# Altium schematic sheet SCH11_Digital_IO.SchDoc: Beaglebone Black - Digital IO
size B; Organization: CWRUbotix; Address1: 10900 Euclid Avenue; Address2: Cleveland, OH 44106; Address3: USA; Revision: 1.0; SheetNumber: 11; SheetTotal: 13
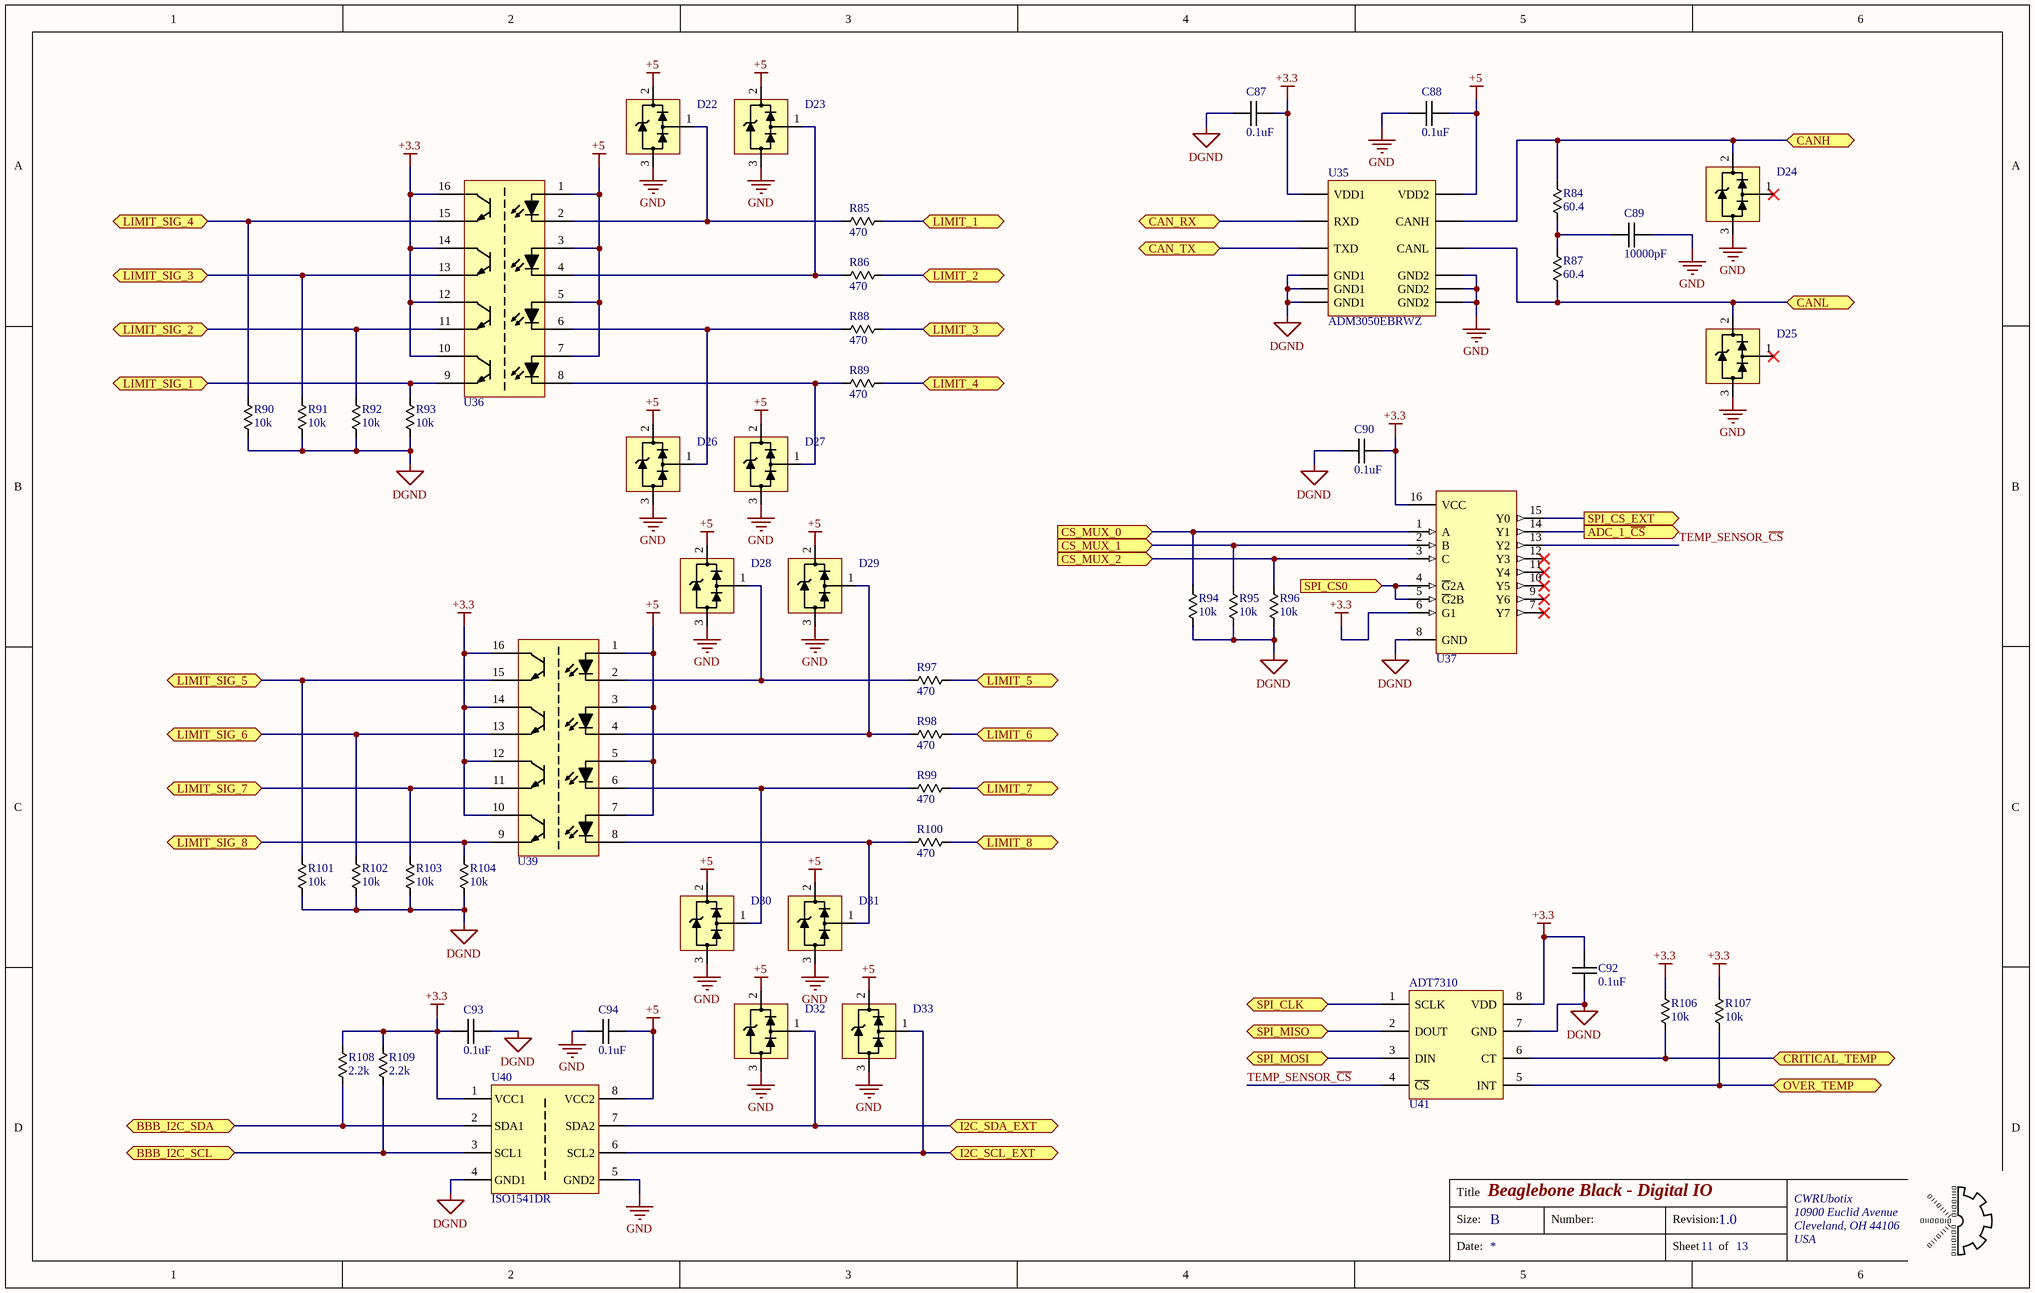
[diagram p0: SCH11_Digital_IO.SchDoc]

## Parts
C87  0.1uF  [chip_0603]
C88  0.1uF  [chip_0603]
C89  10000pF  [chip_0603]
C90  0.1uF  [chip_0603]
C92  0.1uF  [chip_0603]
C93  0.1uF  [chip_0603]
C94  0.1uF  [chip_0603]
D22  DLPT05  [sot-23-3]  (value not drawn)
D23  DLPT05  [sot-23-3]  (value not drawn)
D24  DLPT05  [sot-23-3]  (value not drawn)
D25  DLPT05  [sot-23-3]  (value not drawn)
D26  DLPT05  [sot-23-3]  (value not drawn)
D27  DLPT05  [sot-23-3]  (value not drawn)
D28  DLPT05  [sot-23-3]  (value not drawn)
D29  DLPT05  [sot-23-3]  (value not drawn)
D30  DLPT05  [sot-23-3]  (value not drawn)
D31  DLPT05  [sot-23-3]  (value not drawn)
D32  DLPT05  [sot-23-3]  (value not drawn)
D33  DLPT05  [sot-23-3]  (value not drawn)
R84  60.4  [chip_0805]
R85  470  [chip_0805]
R86  470  [chip_0805]
R87  60.4  [chip_0805]
R88  470  [chip_0805]
R89  470  [chip_0805]
R90  10k  [chip_0603]
R91  10k  [chip_0603]
R92  10k  [chip_0603]
R93  10k  [chip_0603]
R94  10k  [chip_0603]
R95  10k  [chip_0603]
R96  10k  [chip_0603]
R97  470  [chip_0805]
R98  470  [chip_0805]
R99  470  [chip_0805]
R100  470  [chip_0805]
R101  10k  [chip_0603]
R102  10k  [chip_0603]
R103  10k  [chip_0603]
R104  10k  [chip_0603]
R106  10k  [chip_0603]
R107  10k  [chip_0603]
R108  2.2k  [chip_0603]
R109  2.2k  [chip_0603]
U35  ADM3050EBRWZ  [SOW-16]
U36  TLP291-4  [SO-16-6.3mm]  (value not drawn)
U37  74HC138  [SO-16]  (value not drawn)
U39  TLP291-4  [SO-16-6.3mm]  (value not drawn)
U40  ISO1541DR  [SO-8]
U41  ADT7310  [SO-8_1]

## Ports
ADC_1_~{CS} (out), BBB_I2C_SCL (bidir), BBB_I2C_SDA (bidir), CAN_RX (bidir), CAN_TX (bidir), CANH (bidir), CANL (bidir), CRITICAL_TEMP (bidir), CS_MUX_0 (in), CS_MUX_1 (in), CS_MUX_2 (in), I2C_SCL_EXT (bidir), I2C_SDA_EXT (bidir), LIMIT_1 (bidir), LIMIT_2 (bidir), LIMIT_3 (bidir), LIMIT_4 (bidir), LIMIT_5 (bidir), LIMIT_6 (bidir), LIMIT_7 (bidir), LIMIT_8 (bidir), LIMIT_SIG_1 (bidir), LIMIT_SIG_2 (bidir), LIMIT_SIG_3 (bidir), LIMIT_SIG_4 (bidir), LIMIT_SIG_5 (bidir), LIMIT_SIG_6 (bidir), LIMIT_SIG_7 (bidir), LIMIT_SIG_8 (bidir), OVER_TEMP (bidir), SPI_CLK (bidir), SPI_CS0 (in), SPI_CS_EXT (out), SPI_MISO (bidir), SPI_MOSI (bidir)

## Nets
+3.3: C87.1 C90.1 C92.1 C93.2 R106.1 R107.1 R108.2 R109.2 U35.1(VDD1) U36.10 U36.12 U36.14 U36.16 U37.6(G1) U37.16(VCC) U39.10 U39.12 U39.14 U39.16 U40.1(VCC1) U41.8(VDD)
+5: C88.1 C94.1 D22.2(VCC) D23.2(VCC) D26.2(VCC) D27.2(VCC) D28.2(VCC) D29.2(VCC) D30.2(VCC) D31.2(VCC) D32.2(VCC) D33.2(VCC) U35.16(VDD2) U36.1 U36.3 U36.5 U36.7 U39.1 U39.3 U39.5 U39.7 U40.8(VCC2)
DGND: C87.2 C90.2 C92.2 C93.1 R90.2 R91.2 R92.2 R93.2 R94.2 R95.2 R96.2 R101.2 R102.2 R103.2 R104.2 U35.2(GND1) U35.7(GND1) U35.8(GND1) U37.8(GND) U40.4(GND1) U41.7(GND)
GND: C88.2 C89.2 C94.2 D22.3(GND) D23.3(GND) D24.3(GND) D25.3(GND) D26.3(GND) D27.3(GND) D28.3(GND) D29.3(GND) D30.3(GND) D31.3(GND) D32.3(GND) D33.3(GND) U35.9(GND2) U35.10(GND2) U35.15(GND2) U40.5(GND2)
ADC_1_~{CS}: U37.14(Y1) ; port ADC_1_~{CS}
BBB_I2C_SCL: R109.1 U40.3(SCL1) ; port BBB_I2C_SCL
BBB_I2C_SDA: R108.1 U40.2(SDA1) ; port BBB_I2C_SDA
CAN_RX: U35.3(RXD) ; port CAN_RX
CAN_TX: U35.6(TXD) ; port CAN_TX
CANH: D24.2(VCC) R84.1 U35.13(CANH) ; port CANH
CANL: D25.2(VCC) R87.2 U35.12(CANL) ; port CANL
CRITICAL_TEMP: R106.2 U41.6(CT) ; port CRITICAL_TEMP
CS_MUX_0: R94.1 U37.1(A) ; port CS_MUX_0
CS_MUX_1: R95.1 U37.2(B) ; port CS_MUX_1
CS_MUX_2: R96.1 U37.3(C) ; port CS_MUX_2
I2C_SCL_EXT: D33.1(LINE) U40.6(SCL2) ; port I2C_SCL_EXT
I2C_SDA_EXT: D32.1(LINE) U40.7(SDA2) ; port I2C_SDA_EXT
LIMIT_1: R85.2 ; port LIMIT_1
LIMIT_2: R86.2 ; port LIMIT_2
LIMIT_3: R88.2 ; port LIMIT_3
LIMIT_4: R89.2 ; port LIMIT_4
LIMIT_5: R97.2 ; port LIMIT_5
LIMIT_6: R98.2 ; port LIMIT_6
LIMIT_7: R99.2 ; port LIMIT_7
LIMIT_8: R100.2 ; port LIMIT_8
LIMIT_SIG_1: R93.1 U36.9 ; port LIMIT_SIG_1
LIMIT_SIG_2: R92.1 U36.11 ; port LIMIT_SIG_2
LIMIT_SIG_3: R91.1 U36.13 ; port LIMIT_SIG_3
LIMIT_SIG_4: R90.1 U36.15 ; port LIMIT_SIG_4
LIMIT_SIG_5: R101.1 U39.15 ; port LIMIT_SIG_5
LIMIT_SIG_6: R102.1 U39.13 ; port LIMIT_SIG_6
LIMIT_SIG_7: R103.1 U39.11 ; port LIMIT_SIG_7
LIMIT_SIG_8: R104.1 U39.9 ; port LIMIT_SIG_8
OVER_TEMP: R107.2 U41.5(INT) ; port OVER_TEMP
SPI_CLK: U41.1(SCLK) ; port SPI_CLK
SPI_CS0: U37.4(~{G}2A) U37.5(~{G}2B) ; port SPI_CS0
SPI_CS_EXT: U37.15(Y0) ; port SPI_CS_EXT
SPI_MISO: U41.2(DOUT) ; port SPI_MISO
SPI_MOSI: U41.3(DIN) ; port SPI_MOSI
TEMP_SENSOR_~{CS}: U37.13(Y2) U41.4(~{CS})
NetC89_1: C89.1 R84.2 R87.1
NetD22_1: D22.1(LINE) R85.1 U36.2
NetD23_1: D23.1(LINE) R86.1 U36.4
NetD26_1: D26.1(LINE) R88.1 U36.6
NetD27_1: D27.1(LINE) R89.1 U36.8
NetD28_1: D28.1(LINE) R97.1 U39.2
NetD29_1: D29.1(LINE) R98.1 U39.4
NetD30_1: D30.1(LINE) R99.1 U39.6
NetD31_1: D31.1(LINE) R100.1 U39.8

Not connected (* = marked no-connect by the designer): D24 1(LINE)*; D25 1(LINE)*; U35 4(NC1) 5(NC2) 11(NC3) 14(NC4); U37 7(Y7)* 9(Y6)* 10(Y5)* 11(Y4)* 12(Y3)*

## Notes on the sheet
- Title
- Size:
- B
- Number:
- Revision:
- Date:
- Sheet
- of

## Library data of the parts
C87 C88 C90 C92-C94 = CAP-00542: CAP, 0.1uF, ±10%, 16V, X7R, 0603; Manufacturer: Murata; Part Number: CAP-00542; Capacitance: 0.1uF; Tolerance: ±10%; Voltage Rating: 16V; Type: X7R
C89 = CAP-00543: CAP, 10000pF, ±10%, 16V, X7R, 0603; Part Number: CAP-00543; Capacitance: 10000pF; Tolerance: ±10%; Voltage Rating: 16V; Type: X7R
D22-D33 = DIO-00057: TVS, Steering (Rail-Rail), 9.8V Clamping, 17A Peak Pulse, SOT-23; Manufacturer: Diodes Incorporated; Manufacturer PN: DLPT05-7-F; Reverse Breakdown Voltage: 6.0V; Part Number: DIO-00057; Type: TVS; Cost: 0.38
R84 R87 = RES-00161: RES SMD 60.4 OHM 1% 1/8W 0805; Manufacturer: Rohm Semiconductor; Manufacturer PN: KTR10EZPF60R4; Power Rating: 0.125W; Part Number: RES-00161; Resistance: 60.4; Tolerance: 1%
R85 R86 R88 R89 R97-R100 = RES-00237: RES SMD 470 OHM 1% 1/8W 0805; Manufacturer: Rohm Semiconductor; Manufacturer PN: KTR10EZPF4700; Power Rating: 0.125W; Part Number: RES-00237; Resistance: 470; Tolerance: 1%
R90-R96 R101-R104 R106 R107 = RES-00306: RES SMD 10K OHM 1% 1/4W 0603; Manufacturer: Panasonic; Manufacturer PN: ERJ-PA3F1002V; Power Rating: 0.25W; Part Number: RES-00306; Resistance: 10k; Tolerance: 1%; Cost: 0.144
R108 R109 = RES-00365: RES SMD 2.2K OHM 1% 1/4W 0603; Manufacturer: Panasonic; Manufacturer PN: ERJ-PA3F2201V; Power Rating: 0.25W; Part Number: RES-00365; Resistance: 2.2k; Tolerance: 1%
U35 = IFACE-00009: Isolated CANbus Transceiver, Single channel, ADM3050E; Manufacturer: Analog Devices; Part Number: IFACE-00009; Manufacturer PN: ADM3050EBRWZ; Cost: 9.62
U36 U39 = IFACE-00012: Opto-Coupler Array, Photo-Transistor Output, TLP291-4; Manufacturer: Toshiba; Part Number: IFACE-00012; Manufacturer PN: TLP291-4
U37 = LOGIC-00035: IC, 3:8 Decoder/Demux, SOIC-16, 2V-6V; Manufacturer: TI; Manufacturer PN: SN74HC138DR; Part Number: LOGIC-00035; Cost: $0.37
U40 = IFACE-00030: IC, Bidirectional I2C Isolator, 2500 Vrms, Low Power, SOIC-8; Manufacturer: TI; Part Number: IFACE-00030; Manufacturer PN: ISO1541DR; Cost: 4.05
U41 = ANLG-00048: IC, 0.5°C Accurate 16-bit Digital SPI Temperature Sensor, SOIC-8, ADT7310; Manufacturer: Analog Devices; Manufacturer PN: ADT7310TRZ; Part Number: ANLG-00048; Cost: 3.93